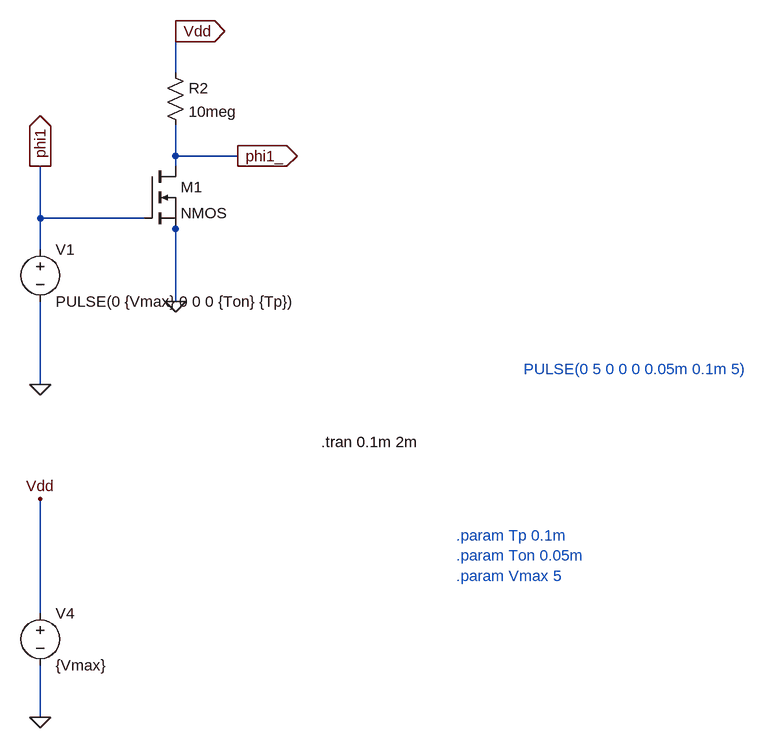
[diagram p0: schematic powerBench.asc]
powerBench.asc, the LTspice schematic file:
Version 4
SHEET 1 2620 864
WIRE 1728 -288 1728 -304
WIRE 1728 -224 1728 -288
WIRE 1728 -96 1728 -144
WIRE 1824 -96 1728 -96
WIRE 1728 -80 1728 -96
WIRE 1520 0 1520 -80
WIRE 1680 0 1520 0
WIRE 1728 16 1728 0
WIRE 1520 48 1520 0
WIRE 1728 128 1728 16
WIRE 1520 256 1520 128
WIRE 1520 608 1520 432
WIRE 1520 768 1520 688
FLAG 1520 768 0
FLAG 1520 432 Vdd
FLAG 1520 256 0
FLAG 1520 -80 phi1
IOPIN 1520 -80 Out
FLAG 1728 128 0
FLAG 1728 -288 Vdd
IOPIN 1728 -288 Out
FLAG 1824 -96 phi1_
IOPIN 1824 -96 Out
SYMBOL voltage 1520 592 R0
SYMATTR InstName V4
SYMATTR Value {Vmax}
SYMBOL voltage 1520 32 R0
SYMATTR InstName V1
SYMATTR Value PULSE(0 {Vmax} 0 0 0 {Ton} {Tp})
SYMBOL nmos 1680 -80 R0
SYMATTR InstName M1
SYMBOL res 1712 -240 R0
SYMATTR InstName R2
SYMATTR Value 10meg
TEXT 2264 232 Left 2 ;PULSE(0 5 0 0 0 0.05m 0.1m 5)
TEXT 2160 488 Left 2 ;.param Tp 0.1m\n.param Ton 0.05m\n.param Vmax 5
TEXT 1952 344 Left 2 !.tran 0.1m 2m

The netlist it stands for:
* powerBench.asc
V4 Vdd 0 {Vmax}
V1 phi1 0 PULSE(0 {Vmax} 0 0 0 {Ton} {Tp})
M1 phi1_ phi1 0 0 NMOS
R2 Vdd phi1_ 10meg
.model NMOS NMOS
.model PMOS PMOS
.lib standard.mos
* PULSE(0 5 0 0 0 0.05m 0.1m 5)
* .param Tp 0.1m
* .param Ton 0.05m
* .param Vmax 5
.tran 0.1m 2m
.backanno
.end